# EasyEDA Pro project ELEC70101_TempSensors.epro

# Schematic Schematic1
Board Name: Board1; Create Date: 2025-11-12; Page Name: P1; Project Name: ELEC70101_Temp; Schematic Name: Schematic1; Update Date: 2025-11-17; Company: EasyEDA.com; Page Size: A4; Version: V1.0
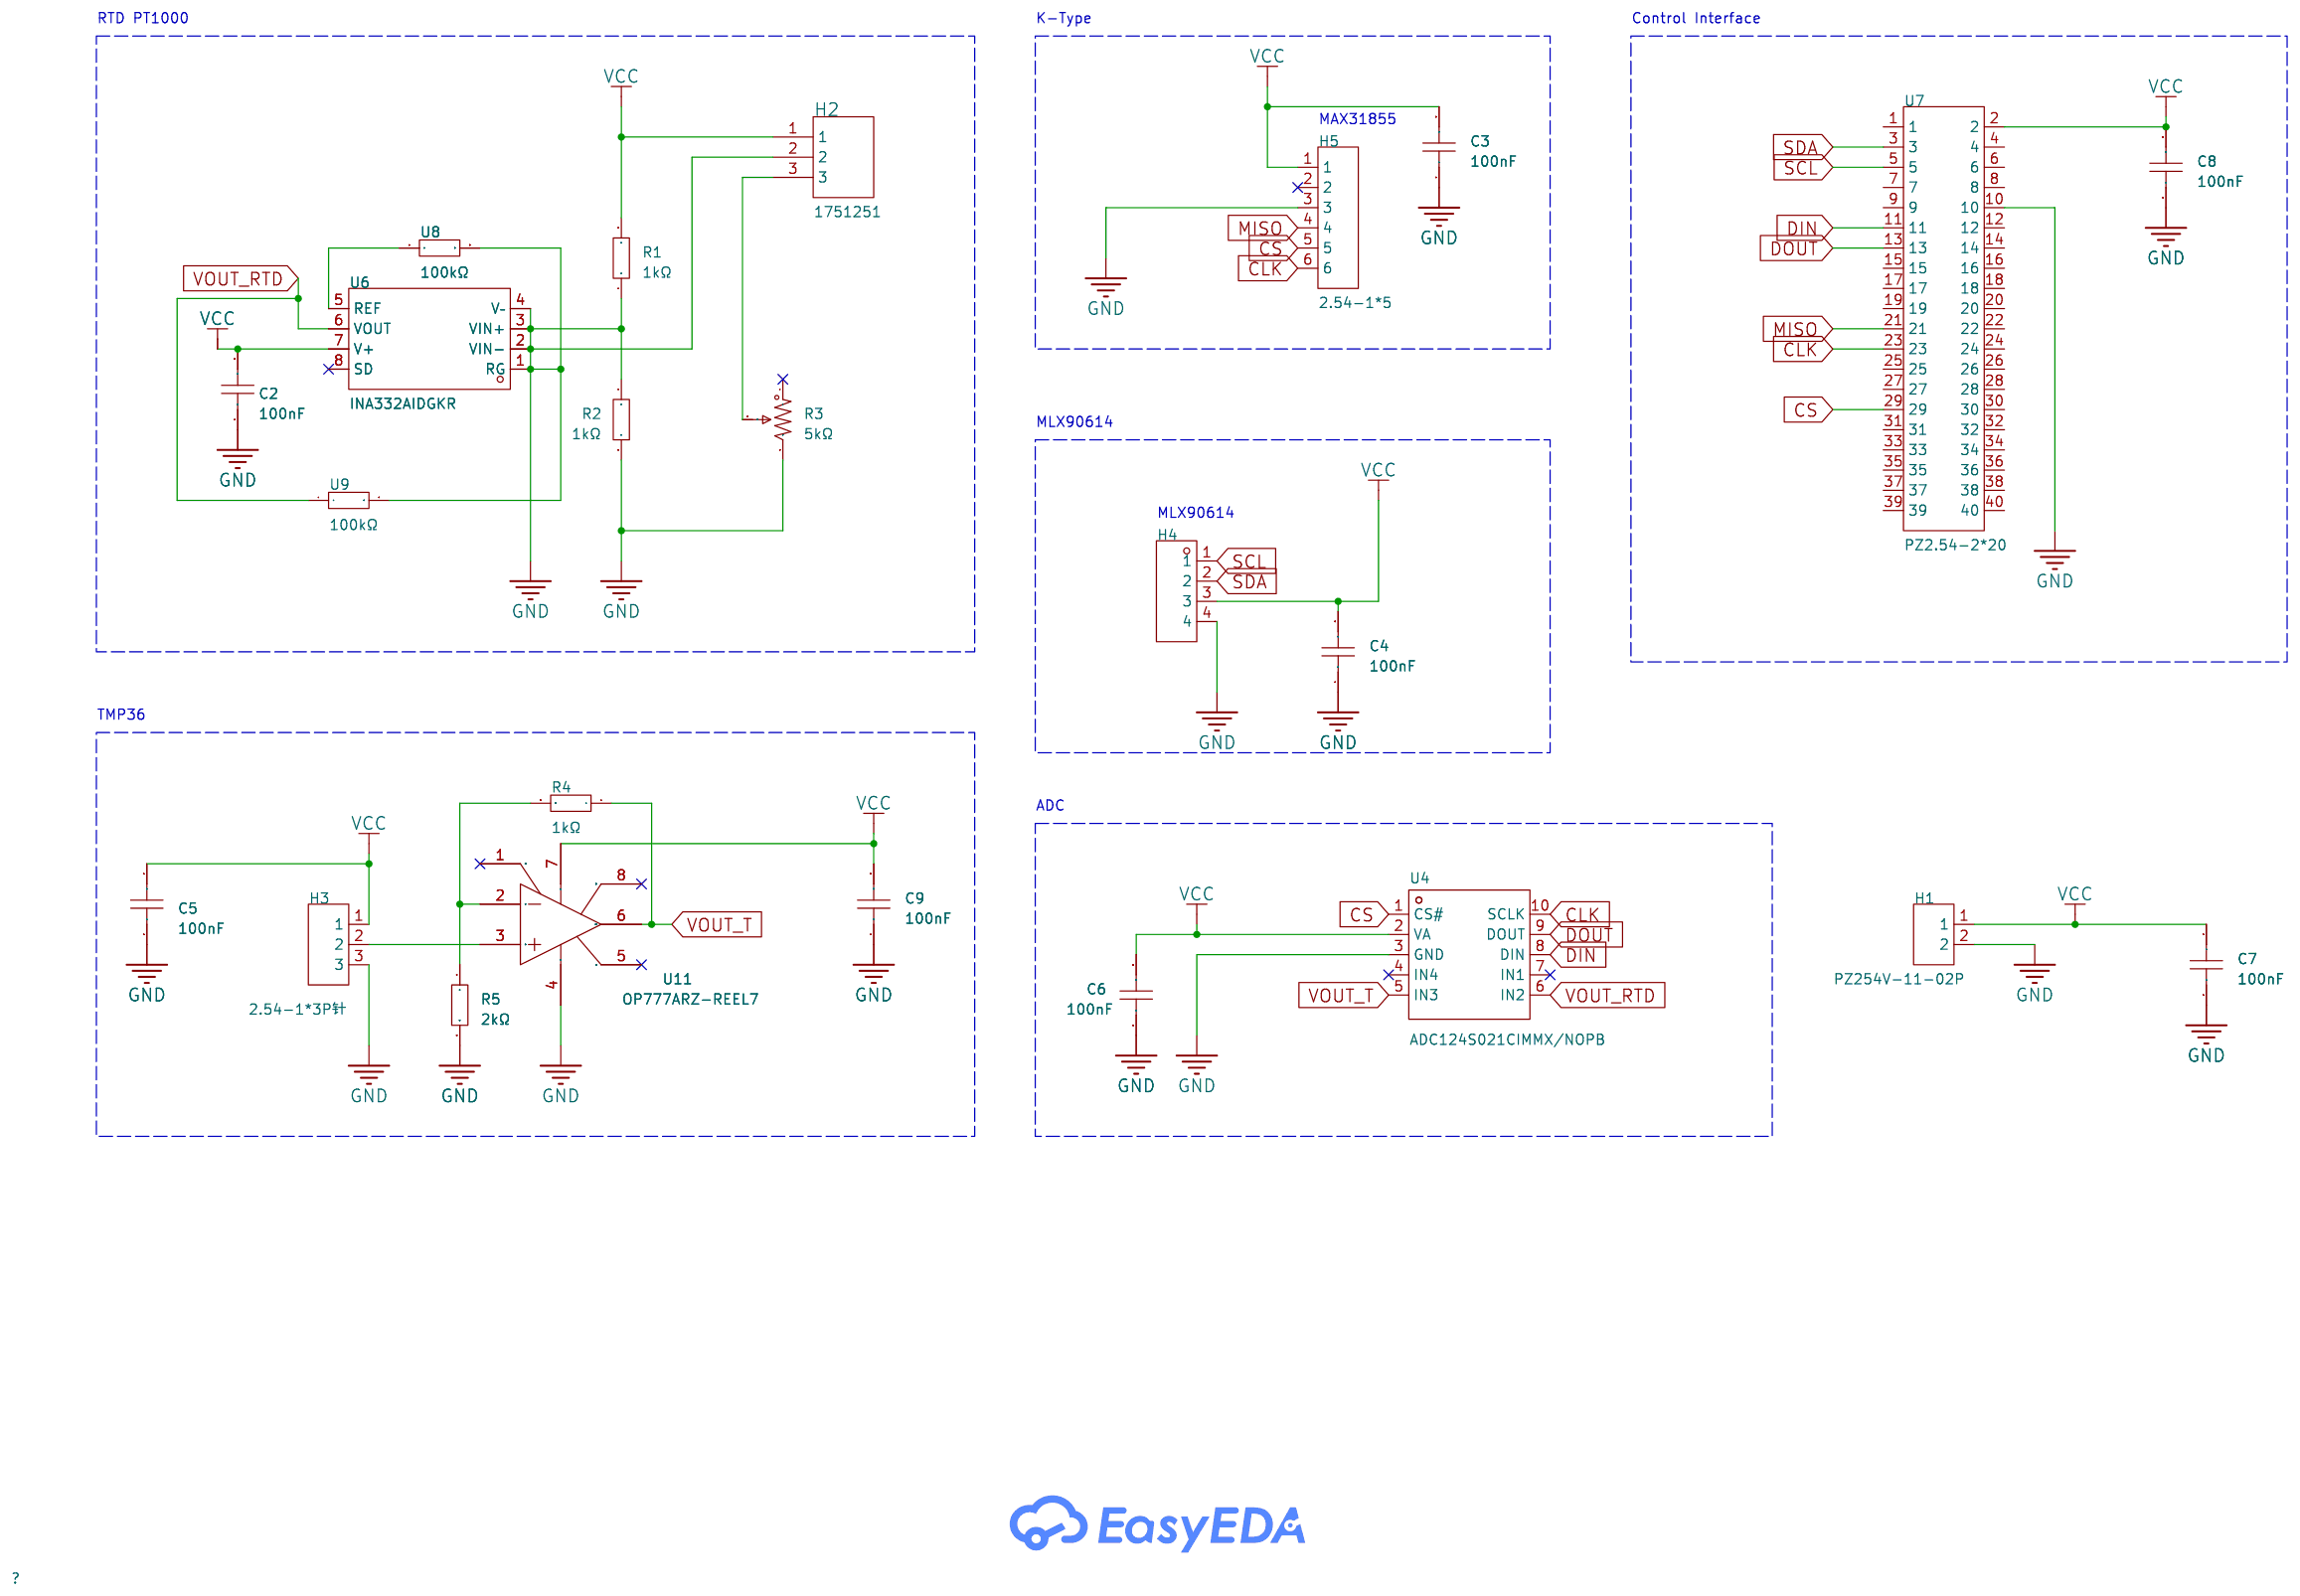
[diagram p0: schematic sheet]

## Parts
C2  100nF  [C0805]
C3  100nF  [C0805]
C4  100nF  [C0805]
C5  100nF  [C0805]
C6  100nF  [C0805]
C7  100nF  [C0805]
C8  100nF  [C0805]
C9  100nF  [C0805]
H1  PZ254V-11-02P  [HDR-TH_2P-P2.54-V-M]
H2  1751251  [CONN-TH_3P-P3.50_1751251]
H3  2.54-1*3P针  [HDR-TH_3P-P2.54-V-M-1]
H4  PZ254V-11-04P  [HDR-TH_4P-P2.54-V-M]
H5  2.54-1*5  [HDR-TH_5P-P2.54-V-M]
R1  1kΩ  [R0603]
R2  1kΩ  [R0603]
R3  5kΩ  [RES-TH_3362P-1-203]
R4  1kΩ  [R0603]
R5  2kΩ  [R0805]
U4  ADC124S021CIMMX/NOPB  [MSOP-10_L3.0-W3.0-P0.50-LS5.0-BL]
U6  INA332AIDGKR  [VSSOP-8_L3.0-W3.0-P0.65-LS5.0-BL]
U7  PZ2.54-2*20  [HDR-TH_40P-P2.54-V-M-R2-C20-S2.54]
U8  100kΩ  [RES-TH_BD5.0-L15.5-P19.50-D0.8]
U9  100kΩ  [RES-TH_BD5.0-L15.5-P19.50-D0.8]
U11  OP777ARZ-REEL7  [SOIC-8_L4.9-W3.9-P1.27-LS6.0-BL]

## Library data of the parts
C2-C9 = CC0805KRX7R9BB104: Capacitance:100nF Tolerance:±10% Tolerance:±10% Voltage Rating:50V Temperature Coefficient:X7R; LCSC Part Name: 100nF ±10% 50V; Supplier Part: C49678; Manufacturer: YAGEO(国巨); Supplier Footprint: 0805; JLCPCB Part Class: Basic Part; Datasheet: https://item.szlcsc.com/datasheet/CC0805KRX7R9BB104/50686.html; Supplier: LCSC; Tolerance: ±10%; Voltage Rating: 50V; Temperature Coefficient: X7R
H1 = PZ254V-11-02P: Pin Structure:1x2P Pitch:2.54mm Row Spacing:- Circluar Pins/Square Pins:Pin Header Mounting Type:Through Hole Number of Rows:1 Number of Pins:2P Current Rating:- Voltage Rating (Max):- Length of Mating Pin:6mm Insulation Height:2.5mm Length of End Connect; LCSC Part Name: 1x2P 间距:2.54mm 方针 直插; Supplier Part: C492401; Manufacturer: XFCN(兴飞); Supplier Footprint: 插件,P=2.54mm; JLCPCB Part Class: Extended Part; Datasheet: https://item.szlcsc.com/datasheet/PZ254V-11-02P/502957.html; Supplier: LCSC; Pin Structure: 1x2P; Pitch: 2.54mm; Circluar Pins/Square Pins: Pin Header; Mounting Type: Through Hole; Number of Rows: 1; Number of Pins: 2P; Length of Mating Pin: 6mm; Insulation Height: 2.5mm; Length of End Connection Pin: 3mm; Contact Material: Brass; Operating Temperature: -40℃~+105℃; Color: Black
H2 = 1751251: Structure:1x3P Pitch:3.5mm Color:Green Mounting Style:Straight Current Rating (Max):13.5A Voltage Rating (Max):200V Number of Pins:3P Number of Rows:1 Wire Gauge - AWG:16~30 Wire Gauge - AWG:16~30 Number of PINs Per Row:3 Operating Temperature Range:- Ope; LCSC Part Name: 3.5mm 1x3P 排数:1 每排P数:3 直插; Supplier Part: C91152; Manufacturer: Phoenix Contact(菲尼克斯); Supplier Footprint: 插件,P=3.5mm; JLCPCB Part Class: Extended Part; Datasheet: https://atta.szlcsc.com/upload/public/pdf/source/20180326/C91152_7755D25AA38AEACF214E4B2E431BC51D.pdf; Supplier: LCSC; Structure: 1x3P; Pitch: 3.5mm; Color: Green; Mounting Style: Straight; Current Rating (Max): 13.5A; Voltage Rating (Max): 200V; Number of Pins: 3P; Number of Rows: 1; Wire Gauge - AWG: 16~30; Number of PINs Per Row: 3
H3 = 2.54-1*3P针: Pin Structure:1x3P Pitch:2.54mm Row Spacing:- Circluar Pins/Square Pins:Pin Header Mounting Type:Through Hole Number of Rows:1 Number of Pins:3P Current Rating:3A Voltage Rating (Max):- Length of Mating Pin:6mm Insulation Height:2.5mm Length of End Connec; LCSC Part Name: 1x3P 间距:2.54mm 方针 直插; Supplier Part: C49257; Manufacturer: BOOMELE(博穆精密); Supplier Footprint: 插件,P=2.54mm; JLCPCB Part Class: Extended Part; Datasheet: https://item.szlcsc.com/datasheet/2.54-1*3P%25E9%2592%2588/50265.html; Supplier: LCSC; Pin Structure: 1x3P; Pitch: 2.54mm; Circluar Pins/Square Pins: Pin Header; Mounting Type: Through Hole; Number of Rows: 1; Number of Pins: 3P; Current Rating: 3A; Length of Mating Pin: 6mm; Insulation Height: 2.5mm; Length of End Connection Pin: 3mm; Contact Material: Brass; Contact Plating: Gold; Operating Temperature: -40℃~+105℃; Color: Black
H4 = PZ254V-11-04P: Pin Structure:1x4P Pitch:2.54mm Row Spacing:- Circluar Pins/Square Pins:Pin Header Mounting Type:Through Hole Number of Rows:1 Number of Pins:4P Current Rating:3A Voltage Rating (Max):250V Length of Mating Pin:6mm Insulation Height:2.5mm Length of End Con; LCSC Part Name: 1x4P 间距:2.54mm 方针 直插; Supplier Part: C2691448; Manufacturer: XFCN(兴飞); Supplier Footprint: 插件,P=2.54mm; JLCPCB Part Class: Extended Part; Datasheet: https://item.szlcsc.com/datasheet/PZ254V-11-04P/2801085.html; Supplier: LCSC; Pin Structure: 1x4P; Pitch: 2.54mm; Circluar Pins/Square Pins: Pin Header; Mounting Type: Through Hole; Number of Rows: 1; Number of Pins: 4P; Current Rating: 3A; Voltage Rating (Max): 250V; Length of Mating Pin: 6mm; Insulation Height: 2.5mm; Length of End Connection Pin: 3mm; Operating Temperature: -40℃~+105℃; Color: Black
H5 = 2.54-1*5: Pin Structure:1x5P Pitch:2.54mm Circluar Pins/Square Pins:Pin Header Mounting Type:Through Hole Number of Rows:1 Number of Pins:5P Current Rating:2.5A Length of Mating Pin:6mm Insulation Height:2.54mm Length of End Connection Pin:3mm Contact Material:Bras; LCSC Part Name: 1x5P 间距:2.54mm 方针 直插; Supplier Part: C5156614; Manufacturer: ZHOURI(洲日); Supplier Footprint: 插件,P=2.54mm; JLCPCB Part Class: Extended Part; Datasheet: https://item.szlcsc.com/datasheet/2.54-1*5/5790714.html; Supplier: LCSC; Pin Structure: 1x5P; Pitch: 2.54mm; Circluar Pins/Square Pins: Pin Header; Mounting Type: Through Hole; Number of Rows: 1; Number of Pins: 5P; Current Rating: 2.5A; Length of Mating Pin: 6mm; Insulation Height: 2.54mm; Length of End Connection Pin: 3mm; Contact Material: Brass; Contact Plating: Gold; Operating Temperature: -40℃~+105℃
R1 R2 R4 = FCR0603F1K: Type:Thick Film Resistor Resistance:1kΩ Tolerance:±1% Tolerance:±1% Power(Watts):100mW Voltage-Supply(Max):75V Operating Temperature:-55℃~+155℃ Operating Temperature:-55℃~+155℃; LCSC Part Name: 1K ±1%; Supplier Part: C5913168; Manufacturer: VO(翔胜); Supplier Footprint: 0603; JLCPCB Part Class: Extended Part; Datasheet: https://atta.szlcsc.com/upload/public/pdf/source/20230428/98B65D379E9BA4CF2A9223D1647B01B6.pdf; Supplier: LCSC; Type: Thick Film Resistor; Tolerance: ±1%; Power(Watts): 100mW; Voltage-Supply(Max): 75V; Operating Temperature: -55℃~+155℃
R3 = 3362P-1-502LF_C49190492: Resistance:5kΩ Tolerance:±10% Tolerance:±10% Power(Watts):500mW Temperature Coefficient:±250ppm/℃ Temperature Coefficient:±250ppm/℃ Number of Turns:; LCSC Part Name: 3362P-1-502LF; Supplier Part: C49190492; Manufacturer: JIERR(捷而瑞); Manufacturer Part: 3362P-1-502LF; Supplier Footprint: 插件-3P,7x6.8mm; JLCPCB Part Class: Extended Part; Datasheet: https://item.szlcsc.com/datasheet/3362P-1-502LF/51587085.html; Supplier: LCSC; Tolerance: ±10%; Power(Watts): 500mW; Temperature Coefficient: ±250ppm/℃
R5 = 0805W8F2001T5E: Type:Thick Film Resistors Resistance:2kΩ Tolerance:±1% Tolerance:±1% Power(Watts): Overload Voltage (Max): Temperature Coefficient:±100ppm/℃ Temperature Coefficient:±100ppm/℃ Operating Temperature Range:-55℃~+155℃ Operating Temperature Range:-55℃~+155℃; LCSC Part Name: 2kΩ ±1% 125mW 厚膜电阻; Supplier Part: C17604; Manufacturer: UNI-ROYAL(厚声); Supplier Footprint: 0805; JLCPCB Part Class: Basic Part; Datasheet: https://atta.szlcsc.com/upload/public/pdf/source/20200306/C422600_1E6D84923E4A46A82E41ADD87F860B5C.pdf; Supplier: LCSC; Type: Thick Film Resistors; Tolerance: ±1%; Temperature Coefficient: ±100ppm/℃; Operating Temperature Range: -55℃~+155℃
U4 = ADC124S021CIMMX/NOPB: Resolution(Bits):12Bit Sampling Rate:50kHz number of channels:4 Voltage - Supply:2.7V~5.25V Voltage - Supply:2.7V~5.25V Interface:SPI；QSPI differential input:- Integral non - linearity:0.35LSB Integral non - linearity:0.35LSB Operating Temperature:-40℃~+8; Supplier Part: C701597; Manufacturer: TI(德州仪器); Supplier Footprint: VSSOP-10; JLCPCB Part Class: Extended Part; Datasheet: https://www.ti.com/cn/lit/gpn/adc124s021; Supplier: LCSC; Resolution(Bits): 12Bit; Sampling Rate: 50kHz; number of channels: 4; Voltage - Supply: 2.7V~5.25V; Interface: SPI；QSPI; Integral non - linearity: 0.35LSB; Operating Temperature: -40℃~+85℃
U6 = INA332AIDGKR: Number of Channels:1.0 Common Mode Rejection Ratio(CMRR):73dB Ib - Input Bias Current:0.5pA Vos - Input Offset Voltage:2.5mV Gain Bandwidth Product:- Slew Rate:5V/us Rail to Rail:Rail-to-Rail Output Output Type:- Quiescent Current(Iq):490uA Input Offset V; LCSC Part Name: 低功耗、单电源CMOS仪表放大器; Supplier Part: C181461; Manufacturer: TI(德州仪器); Supplier Footprint: VSSOP-8; JLCPCB Part Class: Extended Part; Datasheet: https://www.ti.com/cn/lit/gpn/ina332; Supplier: LCSC; Number of Channels: 1.0; Common Mode Rejection Ratio(CMRR): 73dB; Ib - Input Bias Current: 0.5pA; Vos - Input Offset Voltage: 2.5mV; Slew Rate: 5V/us; Rail to Rail: Rail-to-Rail Output; Quiescent Current(Iq): 490uA; Input Offset Voltage Drift(Vos TC): 250uV/℃; Operating Temperature: -55℃~+125℃
U7 = PZ2.54-2*20: Pin Structure:2x20P Pitch:2.54mm Row Spacing:2.54mm Circluar Pins/Square Pins:Pin Header Mounting Type:Through Hole Number of Rows:2 Number of Pins:40P Current Rating:2.5A Length of Mating Pin:6mm Insulation Height:2.54mm Length of End Connection Pin:3mm; LCSC Part Name: 2x20P 间距:2.54mm 方针 直插; Supplier Part: C5224014; Manufacturer: ZHOURI(洲日); Supplier Footprint: 插件,P=2.54mm; JLCPCB Part Class: Extended Part; Datasheet: https://item.szlcsc.com/datasheet/PZ2.54-2*20/5925193.html; Supplier: LCSC; Pin Structure: 2x20P; Pitch: 2.54mm; Row Spacing: 2.54mm; Circluar Pins/Square Pins: Pin Header; Mounting Type: Through Hole; Number of Rows: 2; Number of Pins: 40P; Current Rating: 2.5A; Length of Mating Pin: 6mm; Insulation Height: 2.54mm; Length of End Connection Pin: 3mm; Contact Material: Brass; Contact Plating: Gold; Operating Temperature: -40℃~+105℃
U8 U9 = FMP300JT-73-100K: Type:Metal Film Resistor Resistance:100kΩ Tolerance:±5% Tolerance:±5% Voltage-Supply(Max):750V Power(Watts):3W Temperature Coefficient:±100ppm/℃ Temperature Coefficient:±100ppm/℃ Operating Temperature:-55℃~+155℃ Operating Temperature:-55℃~+155℃; LCSC Part Name: 金属膜电阻 100kΩ ±5% 3W; Supplier Part: C914808; Manufacturer: YAGEO(国巨); Supplier Footprint: 插件,D5xL15.5mm; JLCPCB Part Class: Extended Part; Datasheet: https://item.szlcsc.com/datasheet/FMP300JT-73-100K/986150.html; Supplier: LCSC; Type: Metal Film Resistor; Tolerance: ±5%; Voltage-Supply(Max): 750V; Power(Watts): 3W; Temperature Coefficient: ±100ppm/℃; Operating Temperature: -55℃~+155℃
U11 = OP777ARZ-REEL7: Number of Channels:Single channel Gain Bandwidth Product:700kHz Ib - Input Bias Current:5nA Slew Rate:0.2V/us Output Current:30mA Output Type:- Rail to Rail:- Operating Temperature:-40℃~+85℃ Operating Temperature:-40℃~+85℃; LCSC Part Name: 精密、单通道、单电源、轨到轨输出放大器; Supplier Part: C514449; Manufacturer: ADI(亚德诺); Supplier Footprint: SOIC-8; JLCPCB Part Class: Extended Part; Datasheet: https://atta.szlcsc.com/upload/public/pdf/source/20190419/C386283_44C68BF9B792605EB84A92B72194D9A7.pdf; Supplier: LCSC; Number of Channels: Single channel; Gain Bandwidth Product: 700kHz; Ib - Input Bias Current: 5nA; Slew Rate: 0.2V/us; Output Current: 30mA; Operating Temperature: -40℃~+85℃

## Nets
GND: C2.1 C3.1 C4.1 C5.1 C6.1 C7.1 C8.1 C9.1 H1.2 H2.2 H3.3 H4.4 H5.3 R1.1 R2.1 R2.2 R3.3 R5.2 U4.3(GND) U6.1(RG) U6.2(VIN-) U6.3(VIN+) U6.4(V–) U7.10 U8.2 U9.2 U11.4(V-)
VCC: C2.2 C3.2 C4.2 C5.2 C6.2 C7.2 C8.2 C9.2 H1.1 H2.1 H3.1 H4.3 H5.1 R1.2 U4.2(VA) U6.7(V+) U7.2 U11.7(V+)
CLK: H5.6 U4.10(SCLK) U7.23
CS: H5.5 U4.1(CS#) U7.29
DIN: U4.8(DIN) U7.11
DOUT: U4.9(DOUT) U7.13
MISO: H5.4 U7.21
SCL: H4.1 U7.5
SDA: H4.2 U7.3
VOUT_RTD: U4.6(IN2) U6.6(VOUT) U9.1
VOUT_T: R4.1 U4.5(IN3) U11.6(OUT)
$1N1920: H3.2 U11.3(IN+)
$1N4818: H2.3 R3.2
$1N7645: U6.5(REF) U8.1
$1N8618: R4.2 R5.1 U11.2(IN-)

Not connected (* = marked no-connect by the designer): H5 2*; R3 1*; U4 4(IN4)* 7(IN1)*; U6 8(SD)*; U7 1 4 6 7 8 9 12 14 15 16 17 18 19 20 22 24 25 26 27 28 30 31 32 33 34 35 36 37 38 39 40; U11 1(NC)* 5(NC)* 8(NC)*

## Notes on the sheet
- RTD PT1000
- K-Type
- Control Interface
- MAX31855
- MLX90614
- MLX90614
- TMP36
- ADC

# Board PCB1
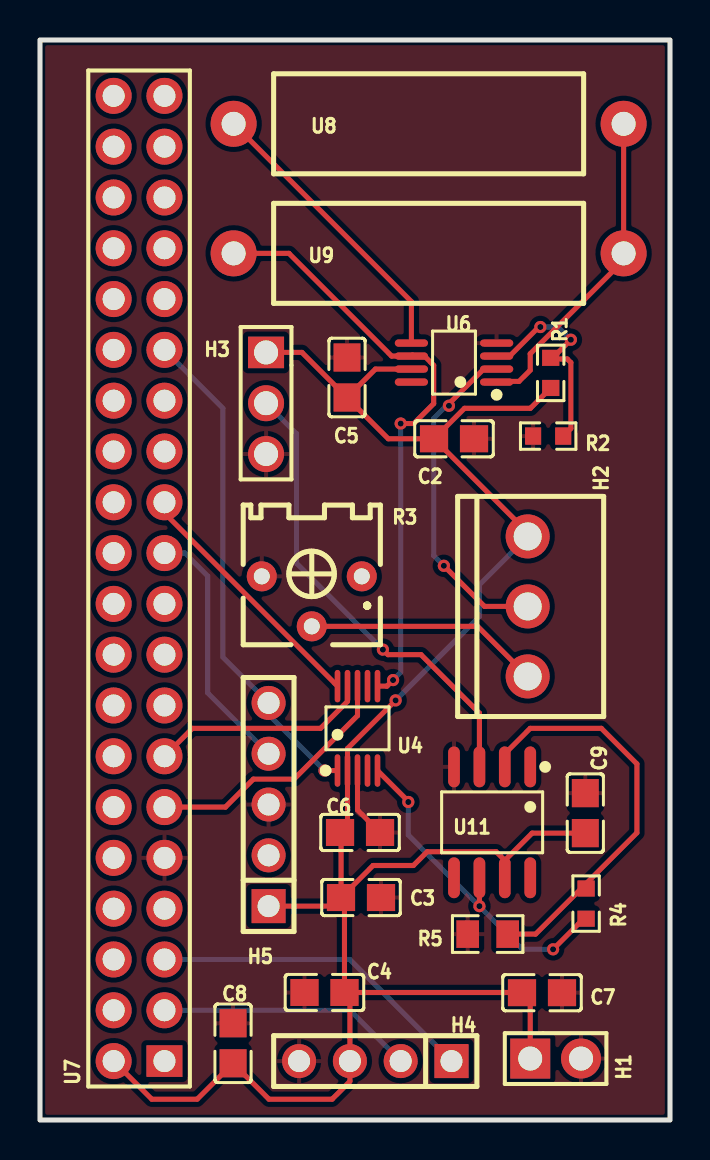
[diagram p1: board, top side]
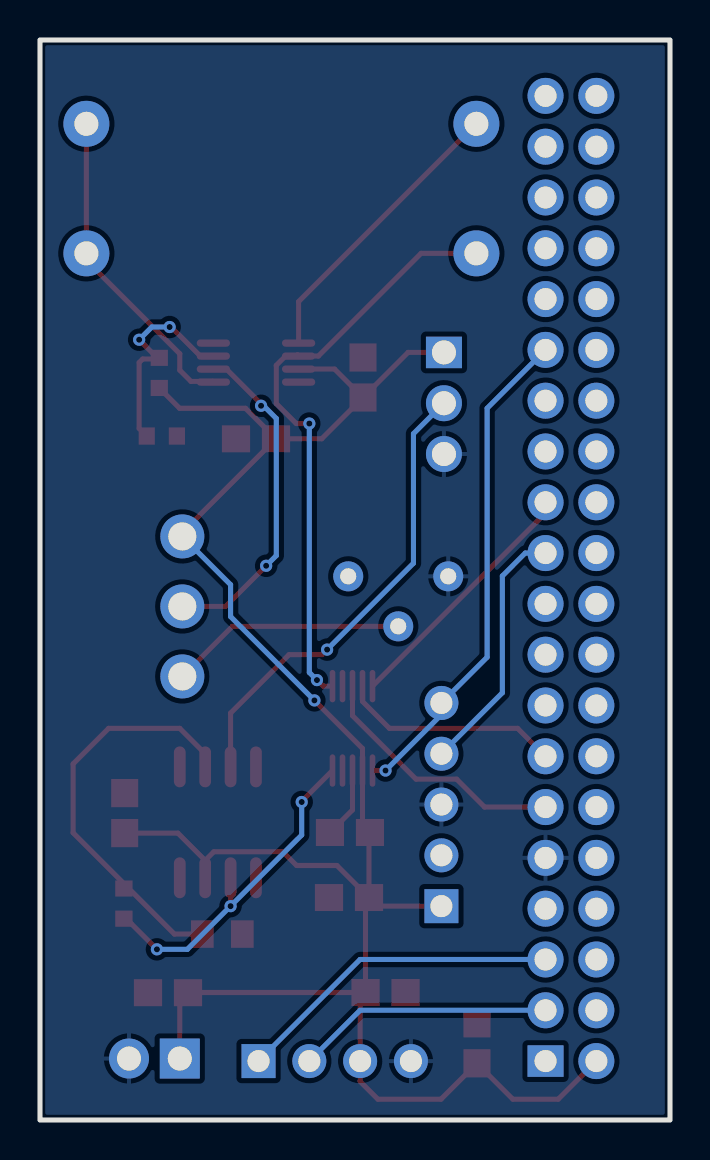
[diagram p2: board, bottom side, seen from below]

Outline 31.5 x 54 mm; copper layers: Top Layer, Bottom Layer. Coordinates in mm from the lower left corner of the outline.
Outline path: rectangle 0,54 31.5,0
Stack: Top Layer 0.035mm / Dielectric1 1.51mm FR4 er 4.5 / Bottom Layer 0.035mm

## Design rules (mm)
template: JLCPCB Capability(Two Layers Board)
spacing copperThickness1oz (default): track to track 0.102, other pairs 0.152 to 0.3
spacing copperThickness2oz: track to track 0.203, other pairs 0.152 to 0.3
track width copperThickness1oz (default): min 0.127, default 0.254, max 2.54
track width copperThickness2oz: min 0.203, default 0.254, max 2.54
differential pair differentialPair (default): width min 0.127, default 0.254, max 2.54; gap min 0.152, default 0.152
via viaSize (default): diameter min 0.5, default 0.61, max 10; hole min 0.3, default 0.305, max 6.3

## Placement (name value [footprint] x y rotation side)
C2  100nF  [C0805]  20.7 34.06 180 top
C3  100nF  [C0805]  16.05 11.12 180 top
C4  100nF  [C0805]  14.22 6.38 0 top
C5  100nF  [C0805]  15.35 37.12 270 top
C6  100nF  [C0805]  16 14.38 180 top
C7  100nF  [C0805]  25.1 6.37 180 top
C8  100nF  [C0805]  9.65 3.84 270 top
C9  100nF  [C0805]  27.27 15.34 270 top
H1  PZ254V-11-02P  [HDR-TH_2P-P2.54-V-M]  25.78 3.07 0 top
H2  1751251  [CONN-TH_3P-P3.50_1751251]  24.38 25.68 270 top
H3  2.54-1*3P针  [HDR-TH_3P-P2.54-V-M-1]  11.3 35.84 270 top
H4  PZ254V-11-04P  [HDR-TH_4P-P2.54-V-M]  16.76 2.95 180 top
H5  2.54-1*5  [HDR-TH_5P-P2.54-V-M]  11.43 15.77 90 top
R1  1kΩ  [R0603]  25.54 37.35 270 top
R2  1kΩ  [R0603]  25.41 34.2 180 top
R3  5kΩ  [RES-TH_3362P-1-203]  13.59 25.93 180 top
R4  1kΩ  [R0603]  27.31 10.82 90 top
R5  2kΩ  [R0805]  22.38 9.3 180 top
U4  ADC124S021CIMMX/NOPB  [MSOP-10_L3.0-W3.0-P0.50-LS5.0-BL]  15.88 19.58 0 top
U6  INA332AIDGKR  [VSSOP-8_L3.0-W3.0-P0.65-LS5.0-BL]  20.7 37.87 90 top
U7  PZ2.54-2*20  [HDR-TH_40P-P2.54-V-M-R2-C20-S2.54]  4.95 27.08 90 top
U8  100kΩ  [RES-TH_BD5.0-L15.5-P19.50-D0.8]  19.43 49.81 0 top
U9  100kΩ  [RES-TH_BD5.0-L15.5-P19.50-D0.8]  19.43 43.33 0 top
U11  OP777ARZ-REEL7  [SOIC-8_L4.9-W3.9-P1.27-LS6.0-BL]  22.61 14.88 180 top

## Footprints (pads in the part's own frame, mm; a bottom-side part is the same pattern mirrored in y, then rotated)
C0805
  rect 1.41x1.35 smd: 1(-1,0) 2(1,0)
CONN-TH_3P-P3.50_1751251
  round 2.2 hole 1.4: 1(-3.5,0) 2(0,0) 3(3.5,0)
HDR-TH_2P-P2.54-V-M
  rect 2x2 hole 1.2: 1(-1.27,0)
  round 2 hole 1.2: 2(1.27,0)
HDR-TH_3P-P2.54-V-M-1
  rect 1.575x1.8 hole 1.2: 1(-2.54,0)
  round 1.8 hole 1.2: 2(0,0) 3(2.54,0)
HDR-TH_4P-P2.54-V-M
  rect 1.7x1.7 hole 1.1: 1(-3.81,0)
  round 1.7 hole 1.1: 2(-1.27,0) 3(1.27,0) 4(3.81,0)
HDR-TH_5P-P2.54-V-M
  rect 1.7x1.7 hole 1.1: 1(-5.08,0)
  round 1.7 hole 1.1: 2(-2.54,0) 3(0,0) 4(2.54,0) 5(5.08,0)
HDR-TH_40P-P2.54-V-M-R2-C20-S2.54
  rect 1.575x1.8 hole 1.1: 1(-24.13,-1.27)
  round 1.8 hole 1.1: 2(-24.13,1.27) 3(-21.59,-1.27) 4(-21.59,1.27) 5(-19.05,-1.27) 6(-19.05,1.27) 7(-16.51,-1.27) 8(-16.51,1.27) 9(-13.97,-1.27) 10(-13.97,1.27) 11(-11.43,-1.27) 12(-11.43,1.27) 13(-8.89,-1.27) 14(-8.89,1.27) 15(-6.35,-1.27) 16(-6.35,1.27) 17(-3.81,-1.27) 18(-3.81,1.27) 19(-1.27,-1.27) 20(-1.27,1.27) 21(1.27,-1.27) 22(1.27,1.27) 23(3.81,-1.27) 24(3.81,1.27) 25(6.35,-1.27) 26(6.35,1.27) 27(8.89,-1.27) 28(8.89,1.27) 29(11.43,-1.27) 30(11.43,1.27) 31(13.97,-1.27) 32(13.97,1.27) 33(16.51,-1.27) 34(16.51,1.27) 35(19.05,-1.27) 36(19.05,1.27) 37(21.59,-1.27) 38(21.59,1.27) 39(24.13,-1.27) 40(24.13,1.27)
MSOP-10_L3.0-W3.0-P0.50-LS5.0-BL
  oval 0.28x1.62 smd: 1(-1,-2.11) 2(-0.5,-2.11) 3(0,-2.11) 4(0.5,-2.11) 5(1,-2.11) 6(1,2.11) 7(0.5,2.11) 8(0,2.11) 9(-0.5,2.11) 10(-1,2.11)
R0603
  rect 0.806x0.864 smd: 1(-0.753,0) 2(0.753,0)
R0805
  rect 1.133x1.377 smd: 1(-1,0) 2(1,0)
RES-TH_3362P-1-203
  round 1.5 hole 0.8: 1(-2.5,-1.25) 2(0,1.25) 3(2.5,-1.25)
RES-TH_BD5.0-L15.5-P19.50-D0.8
  round 2.3 hole 1.2: 1(-9.75,0) 2(9.75,0)
SOIC-8_L4.9-W3.9-P1.27-LS6.0-BL
  oval 0.588x2.045 smd: 1(-1.905,-2.772) 2(-0.635,-2.772) 3(0.635,-2.772) 4(1.905,-2.772) 5(1.905,2.772) 6(0.635,2.772) 7(-0.635,2.772) 8(-1.905,2.772)
VSSOP-8_L3.0-W3.0-P0.65-LS5.0-BL
  oval 0.364x1.662 smd: 1(-0.975,-2.131) 2(-0.325,-2.131) 3(0.325,-2.131) 4(0.975,-2.131) 5(0.975,2.131) 6(0.325,2.131) 7(-0.325,2.131) 8(-0.975,2.131)

## Nets
GND: C2.1 C3.1 C4.1 C5.1 C6.1 C7.1 C8.1 C9.1 H1.2 H3.3 H4.4 H5.3 R2.2 R3.3 R5.2 U4.3 U6.4 U7.9 U11.4
VCC: C2.2 C3.2 C4.2 C5.2 C6.2 C7.2 C8.2 C9.2 H1.1 H2.1 H3.1 H4.3 H5.1 R1.2 U4.2 U6.7 U7.2 U11.7
CLK: U4.10 U7.23
CS: H5.5 U4.1 U7.29
DIN: U4.8 U7.11
DOUT: U4.9 U7.13
MISO: H5.4 U7.21
SCL: H4.1 U7.5
SDA: H4.2 U7.3
VOUT_RTD: U4.6 U6.6 U9.1
VOUT_T: R4.1 U4.5 U11.6
$1N1920: H3.2 U11.3
$1N4691: R1.1 R2.1 U6.3
$1N4818: H2.3 R3.2
$1N4878: H2.2 U6.2
$1N7645: U6.5 U8.1
$1N7690: U6.1 U8.2 U9.2
$1N8618: R4.2 R5.1 U11.2

Pads without a net: H5 2; R3 1; U4 4 7; U6 8; U7 1 4 6 7 8 10 12 14 15 16 17 18 19 20 22 24 25 26 27 28 30 31 32 33 34 35 36 37 38 39 40; U11 1 5 8

## Via types
v1: diameter 0.61, hole 0.305, Top Layer to Bottom Layer, 12 vias

## Routing (per net, layer and track width the routed paths; a pad name or vN(x,y) marks a point on that pad's centre or on a via; arc(x,y) is an arc through that point)
GND: length 3.6
  Top Layer w0.254: C6.1 15.88,15.5 U4.3
VCC: length 104.4
  Top Layer w0.254: H5.1 14.62,10.69 C3.2 ; C5.2 13.1,38.38 H3.1 ; C5.2 17.41,34.06 C2.2 ; C5.2 16.77,37.55 U6.7 ; C2.2 24.38,29.38 H2.1 ; C2.2 21.22,35.59 24.52,35.59 R1.2 ; C3.2 15.05,14.33 C6.2 15.38,14.75 U4.2 15.38,18.58 v1(17.78,20.98) ; C3.2 16.65,12.73 18.67,12.73 19.36,13.41 22.81,13.41 23.24,12.98 ; C3.2 15.22,10.95 C4.2 ; 23.24,12.98 U11.7 ; 23.24,12.98 24.61,14.34 C9.2 ; C4.2 24.09,6.38 C7.2 24.51,5.95 H1.1 ; C4.2 15.49,6.11 H4.3 15.49,1.93 14.6,1.04 11.45,1.04 C8.2 7.86,1.04 5.59,1.04 U7.2
  Bottom Layer w0.254: v1(17.78,20.98) 21.97,25.17 21.97,26.77 H2.1
CLK: length 12.8
  Top Layer w0.254: U4.10 6.22,30.34 U7.23
CS: length 25
  Top Layer w0.254: U4.1 v1(14.22,17.47)
  Bottom Layer w0.254: U7.29 9.14,35.59 9.14,23.14 H5.5 11.43,20.27 v1(14.22,17.47)
DIN: length 13
  Top Layer w0.254: U4.8 15.88,20.22 12.7,17.04 10.67,17.04 9.27,15.65 6.22,15.65
DOUT: length 11.1
  Top Layer w0.254: U7.13 7.62,19.58 14.03,19.58 15.38,20.93 U4.9
MISO: length 12.8
  Bottom Layer w0.254: H5.4 8.38,21.36 8.38,27.2 7.24,28.35 U7.21
SCL: length 16.5
  Bottom Layer w0.254: H4.1 15.49,8.03 U7.5
SDA: length 12.9
  Bottom Layer w0.254: H4.2 15.49,5.49 U7.3
VOUT_RTD: length 30.2
  Top Layer w0.254: v1(17.65,22) 17.35,21.69 U4.6 ; v1(18.03,34.82) 18.69,34.82 19.69,35.82 19.69,37.73 19.22,38.2 18.68,38.2 18.63,38.25 U6.6 17.58,38.2 12.45,43.33 U9.1
  Bottom Layer w0.254: v1(18.03,34.82) 18.03,22.38 v1(17.65,22)
VOUT_T: length 17.1
  Top Layer w0.254: v1(18.41,15.9) 18.41,15.93 U4.5 ; v1(25.65,8.53) 26.94,9.82 27.31,9.82 ; U11.6 v1(21.97,10.69)
  Bottom Layer w0.254: v1(18.41,15.9) 18.41,14.25 v1(21.97,10.69) 24.13,8.53 v1(25.65,8.53)
$1N1920: length 23.6
  Top Layer w0.254: v1(17.15,23.52) 17.4,23.27 19.05,23.27 21.97,20.34 U11.3
  Bottom Layer w0.254: H3.2 12.83,34.32 12.83,27.84 v1(17.15,23.52)
$1N4691: length 10.9
  Top Layer w0.254: R2.1 26.54,34.58 26.54,37.87 26.36,38.05 25.59,38.05 25.54,38.11 25.64,38.11 v1(26.54,39.01) ; U6.3 23.48,38.2 24.94,39.65 v1(25.02,39.65)
  Bottom Layer w0.254: v1(25.02,39.65) 25.91,39.65 v1(26.54,39.01)
$1N4818: length 11.8
  Top Layer w0.254: H2.3 21.88,24.68 R3.2
$1N4878: length 16.8
  Top Layer w0.254: v1(20.45,35.71) 20.45,35.81 22.18,37.55 U6.2 ; v1(20.19,27.71) 22.22,25.68 H2.2
  Bottom Layer w0.254: v1(20.45,35.71) 20.32,35.71 19.69,35.08 19.69,28.22 v1(20.19,27.71)
$1N7645: length 14.6
  Top Layer w0.254: U6.5 18.57,40.92 U8.1
$1N7690: length 16.2
  Top Layer w0.254: U6.1 22.87,36.93 23.95,36.93 24.51,37.49 24.51,38.31 29.18,42.98 U9.2 U8.2
$1N8618: length 20.5
  Top Layer w0.254: U11.2 23.24,18.31 24.51,19.58 28.07,19.58 29.84,17.81 29.84,14.36 24.78,9.3 R5.1

## Copper pours and planes (outline as drawn; the poured copper is in the pictures)
GND on Top Layer: 0,54 31.5,54 31.5,0 0,0
GND on Bottom Layer: 0,54 31.5,54 31.5,0 0,0
